# Altium schematic sheet iRat_2.1.SchDoc
size A4
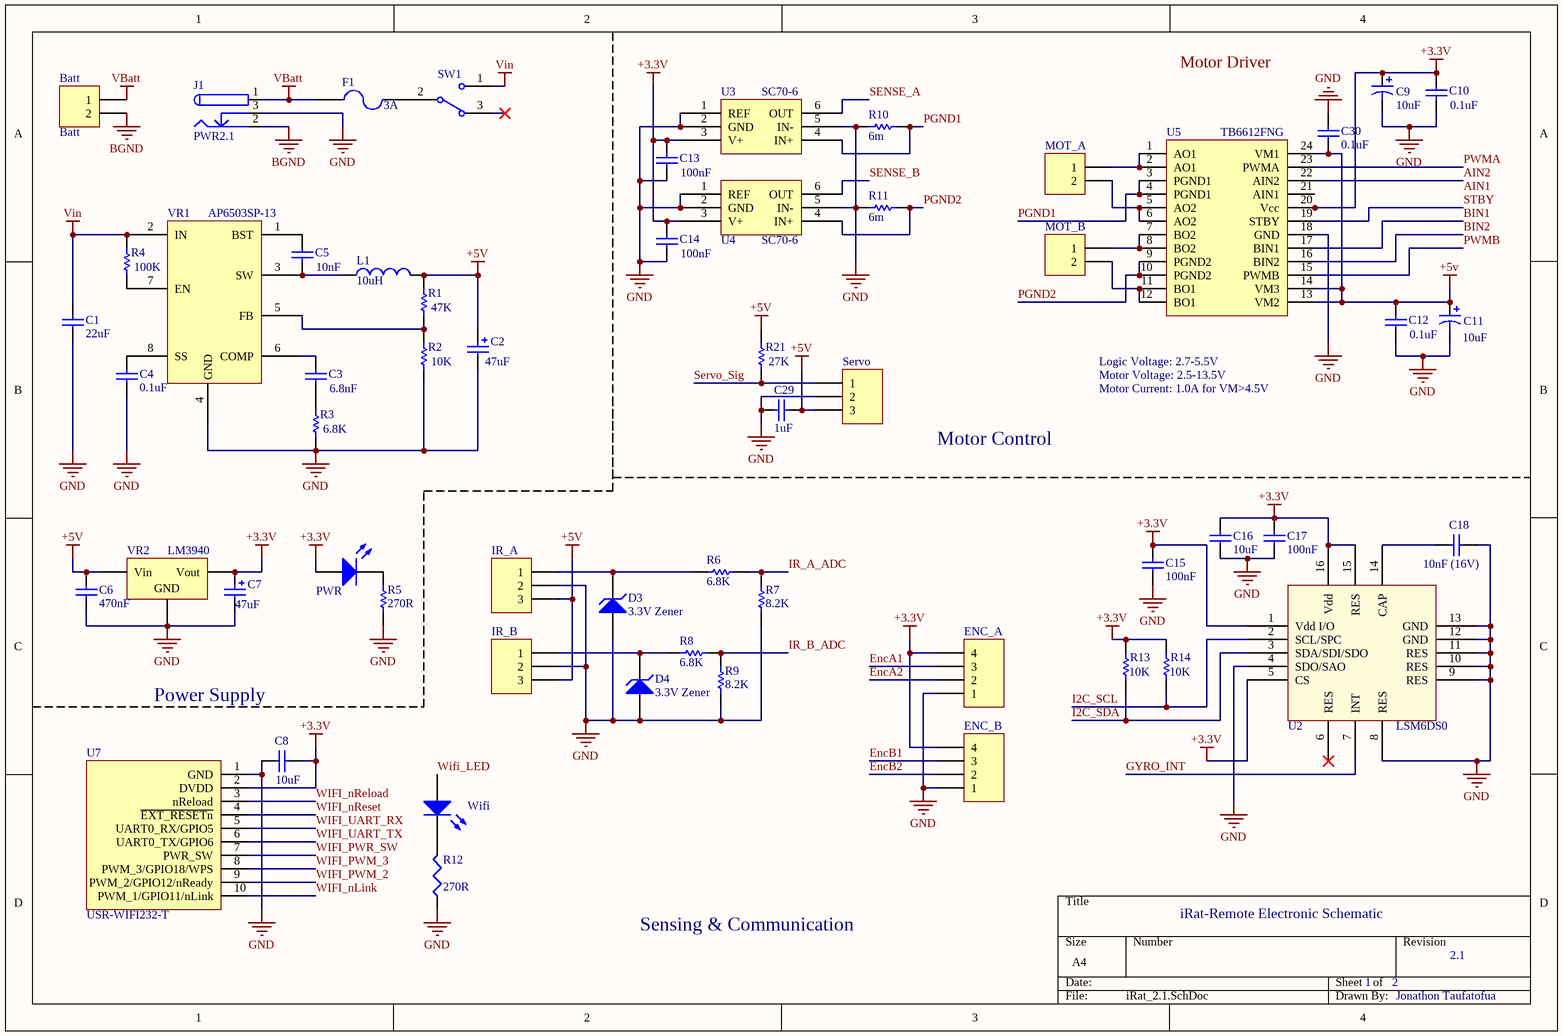
[diagram p0: iRat_2.1.SchDoc]

## Parts
Batt  Batt  [Molex 43045-0202]
C1  value 22uF  [0805E]  (hidden comment: Cap Semi)
C2  value 47uF  [Capacitor_SizeD8]  (hidden comment: Cap Pol2)
C3  value 6.8nF  [1608[0603]]  (hidden comment: Cap Semi)
C4  value 0.1uF  [1608[0603]]  (hidden comment: Cap Semi)
C5  value 10nF  [1608[0603]]  (hidden comment: Cap Semi)
C6  value 470nF  [1608[0603]]  (hidden comment: Cap Semi)
C7  value 47uF  [Capacitor_SizeD8]  (hidden comment: Cap Pol2)
C8  value 10uF  [6-0805_N]  (hidden comment: Cap Semi)
C9  value 10uF  [C0805]  (hidden comment: Cap Pol3)
C10  value 0.1uF  [1608[0603]]  (hidden comment: Cap Semi)
C11  value 10uF  [C0805]  (hidden comment: Cap Pol3)
C12  value 0.1uF  [1608[0603]]  (hidden comment: Cap Semi)
C13  value 100nF  [1608[0603]]  (hidden comment: Cap Semi)
C14  value 100nF  [1608[0603]]  (hidden comment: Cap Semi)
C15  value 100nF  [1608[0603]]  (hidden comment: Cap Semi)
C16  value 10uF  [0805E]  (hidden comment: Cap Semi)
C17  value 100nF  [1608[0603]]  (hidden comment: Cap Semi)
C18  value 10nF (16V)  [1608[0603]]  (hidden comment: Req 10nF 10%, 16V Ceramic)
C29  value 1uF  [1608[0603]]  (hidden comment: Cap Semi)
C30  value 0.1uF  [1608[0603]]  (hidden comment: Cap Semi)
D3  3.3V Zener  [MM5Z3V3T1G]
D4  3.3V Zener  [MM5Z3V3T1G]
ENC_A  Header 4  [JST PH 4-Way]  (value not drawn)
ENC_B  Header 4  [JST PH 4-Way]  (value not drawn)
F1  3A  [1812]
IR_A  Header 3  [JST PH 3-Way]  (value not drawn)
IR_B  Header 3  [JST PH 3-Way]  (value not drawn)
J1  PWR2.1  [DCP21]
L1  value 10uH  [SRP7028A-100M]  (hidden comment: Inductor)
MOT_A  Header 2  [HDR1X2]  (value not drawn)
MOT_B  Header 2  [HDR1X2]  (value not drawn)
PWR  LNJ347W83RA  [0402-A]  (value not drawn)
R1  value 47K  [J1-0603]  (hidden comment: Res Semi)
R2  value 10K  [J1-0603]  (hidden comment: Res Semi)
R3  value 6.8K  [J1-0603]  (hidden comment: Res Semi)
R4  value 100K  [J1-0603]  (hidden comment: Res Semi)
R5  value 270R  [0402]  (hidden comment: Res1)
R6  value 6.8K  [0603E]  (hidden comment: Res1)
R7  value 8.2K  [0603E]  (hidden comment: Res1)
R8  value 6.8K  [0603E]  (hidden comment: Res1)
R9  value 8.2K  [0603E]  (hidden comment: Res1)
R10  value 6m  [ERJM1WS]  (hidden comment: Shunt Resistor)
R11  value 6m  [ERJM1WS]  (hidden comment: Shunt Resistor)
R12  value 270R  [0402]  (hidden comment: Res3)
R13  value 10K  [0402]  (hidden comment: Res Semi)
R14  value 10K  [0402]  (hidden comment: Res Semi)
R21  value 27K  [0402]  (hidden comment: Res Semi)
Servo  Servo1  [JST PH 3-Way]  (value not drawn)
SW1  SW-SPDT  [Slide_Switch]  (value not drawn)
U2  LSM6DS0  [LGA16-3X3X1_N]
U3  SC70-6  [SC70]
U4  SC70-6  [SC70]
U5  TB6612FNG  [TSOP65P760X160-24N]
U7  USR-WIFI232-T  [USR-WIFI232-T]
VR1  AP6503SP-13  [SO-8EP]
VR2  LM3940  [SOT223_N]
Wifi  LNJ347W83RA  [0402-A]  (value not drawn)

## Nets
+3.3V: C7.1 C8.1 C9.1 C10.1 C13.2 C14.2 C15.2 C16.2 C17.2 ENC_A.4 ENC_B.4 PWR.1(A) R13.2 R14.2 U2.1(Vdd_I/O) U2.5(CS) U2.15(RES) U2.16(Vdd) U3.3(V+) U4.3(V+) U5.20(Vcc) U7.2(DVDD) VR2.3(Vout)
+5v: C2.1 C6.2 C11.1 C12.1 C29.2 C30.1 IR_A.3 IR_B.3 L1.2 R1.2 R21.2 Servo.3 U5.13(VM2) U5.14(VM3) U5.24(VM1) VR2.1(Vin)
BGND: Batt.2 J1.2
GND: C1.1 C2.2 C4.1 C6.1 C7.2 C8.2 C9.2 C10.2 C11.2 C12.2 C13.1 C14.1 C15.1 C16.1 C17.1 C18.1 C29.1 C30.2 D3.1(A) D4.1(A) ENC_A.1 ENC_B.1 IR_A.2 IR_B.2 J1.3 R2.1 R3.1 R5.1 R7.1 R9.1 R10.2 R11.1 R12.1 Servo.2 U2.4(SDO/SAO) U2.8(RES) U2.9(RES) U2.10(RES) U2.11(RES) U2.12(GND) U2.13(GND) U3.1(REF) U3.2(GND) U3.5(IN-) U4.1(REF) U4.2(GND) U4.5(IN-) U5.18(GND) U7.1(GND) VR1.4(GND) VR2.2(GND)
VBatt: Batt.1 F1.1 J1.1
Vin: C1.2 R4.2 SW1.1 VR1.2(IN)
AIN2: U5.22(AIN2)
BIN1: U5.17(BIN1)
BIN2: U5.16(BIN2)
EncA1: ENC_A.3
EncA2: ENC_A.2
EncB1: ENC_B.3
EncB2: ENC_B.2
GYRO_INT: U2.7(INT)
I2C_SCL: R14.1 U2.2(SCL/SPC)
I2C_SDA: R13.1 U2.3(SDA/SDI/SDO)
IR_A_ADC: R6.1 R7.2
IR_B_ADC: R8.1 R9.2
PGND1: R10.1 U3.4(IN+) U5.3(PGND1) U5.4(PGND1)
PGND2: R11.2 U4.4(IN+) U5.9(PGND2) U5.10(PGND2)
PWMA: U5.23(PWMA)
PWMB: U5.15(PWMB)
SENSE_A: U3.6(OUT)
SENSE_B: U4.6(OUT)
Servo_Sig: R21.1 Servo.1
STBY: U5.19(STBY)
Wifi_LED: Wifi.1(A)
WIFI_nLink: U7.10(PWM_1/GPIO11/nLink)
WIFI_nReload: U7.3(nReload)
WIFI_nReset: U7.4(~{EXT_RESETn})
WIFI_PWM_2: U7.9(PWM_2/GPIO12/nReady)
WIFI_PWM_3: U7.8(PWM_3/GPIO18/WPS)
WIFI_PWR_SW: U7.7(PWR_SW)
WIFI_UART_RX: U7.5(UART0_RX/GPIO5)
WIFI_UART_TX: U7.6(UART0_TX/GPIO6)
NetC3_1: C3.1 R3.2
NetC3_2: C3.2 VR1.6(COMP)
NetC4_2: C4.2 VR1.8(SS)
NetC5_1: C5.1 L1.1 VR1.3(SW)
NetC5_2: C5.2 VR1.1(BST)
NetC18_2: C18.2 U2.14(CAP)
NetD3_2: D3.2(K) IR_A.1 R6.2
NetD4_2: D4.2(K) IR_B.1 R8.2
NetF1_2: F1.2 SW1.2
NetMOT_A_1: MOT_A.1 U5.1(AO1) U5.2(AO1)
NetMOT_A_2: MOT_A.2 U5.5(AO2) U5.6(AO2)
NetMOT_B_1: MOT_B.1 U5.7(BO2) U5.8(BO2)
NetMOT_B_2: MOT_B.2 U5.11(BO1) U5.12(BO1)
NetPWR_2: PWR.2(K) R5.2
NetR1_1: R1.1 R2.2 VR1.5(FB)
NetR4_1: R4.1 VR1.7(EN)
NetR12_2: R12.2 Wifi.2(K)

Not connected (* = marked no-connect by the designer): SW1 3*; U2 6(RES)*; U5 21(AIN1); VR2 4(GND)

## Notes on the sheet
- Motor Driver
- Logic Voltage: 2.7-5.5V
- Motor Voltage: 2.5-13.5V
- Motor Control
- Motor Current: 1.0A for VM>4.5V
- Power Supply
- iRat-Remote Electronic Schematic
- Sensing & Communication
- 1
- 2
- 2.1
- Jonathon Taufatofua
- Labels drawn without touching a wire or pin: AIN1

## Library data of the parts
Batt MOT_A MOT_B = Header 2: Header, 2-Pin; LatestRevisionDate: 17-Jul-2002; LatestRevisionNote: Re-released for DXP Platform.; Publisher: Altium Limited
C1 C3-C6 C8 C10 C12-C18 C29 C30 = Cap Semi: Capacitor (Semiconductor SIM Model); Published: 8-Jun-2000; LatestRevisionDate: 29-May-2009; LatestRevisionNote: IPC-7351 Footprint Added.; PackageReference: C1206; Publisher: Altium Limited; PackageDescription: Chip Capacitor
C2 = Cap Pol2: Polarized Capacitor (Radial); Published: 8-Jun-2000; LatestRevisionDate: 17-Jul-2002; LatestRevisionNote: Re-released for DXP Platform.; PackageReference: POLAR0.8; Publisher: Altium Limited; PackageDescription: Polarized Capacitor; 2 Leads
C7 = Cap Pol2: Polarized Capacitor (Radial); Note: Needs at least 33uF for stability
C9 C11 = Cap Pol3: Polarized Capacitor (Surface Mount); Published: 8-Jun-2000; LatestRevisionDate: 29-May-2009; LatestRevisionNote: IPC-7351 Footprint Added.; PackageReference: C0805; Publisher: Altium Limited; PackageDescription: Chip Capacitor
D3 D4 = D Zener: Zener Diode; Published: 8-Jun-2000; LatestRevisionDate: 17-Jul-2002; LatestRevisionNote: Re-released for DXP Platform.; PackageReference: DIODE-0.7; Publisher: Altium Limited; PackageDescription: Diode, Thru-Hole; 2 Leads; 0.7 in Pin Spacing
ENC_A ENC_B = Header 4: Header, 4-Pin; LatestRevisionDate: 17-Jul-2002; LatestRevisionNote: Re-released for DXP Platform.; Publisher: Altium Limited
F1 = Fuse 2: Fuse; Published: 8-Jun-2000; LatestRevisionDate: 17-Jul-2002; LatestRevisionNote: Re-released for DXP Platform.; PackageReference: PIN-W2/E2.8; Publisher: Altium Limited; PackageDescription: Thru-Hole; 2 Leads
IR_A IR_B Servo = Header 3: Header, 3-Pin; LatestRevisionDate: 17-Jul-2002; LatestRevisionNote: Re-released for DXP Platform.; Publisher: Altium Limited
J1 = PWR2.5: Low Voltage Power Supply Connector; Published: 17-Dec-2003; DatasheetDocument: 09-May-2002; Publisher: Altium Limited; ComponentLink1Description: Manufacturer Link; ComponentLink1URL: http://domino.kycon.com/internet/Products.html
L1 = Inductor: Code_IEC: 1005; Published: 8-Jun-2000; LatestRevisionDate: 29-May-2009; LatestRevisionNote: IPC-7351 Footprint Added.; PackageReference: 0402-A; Publisher: Altium Limited; PackageDescription: Chip Inductor; Code_JEITA: 0402
PWR = LED2: GREEN Power LED; Published: 8-Jun-2000; LatestRevisionDate: 17-Jul-2002; LatestRevisionNote: Re-released for DXP Platform.; PackageVersion: Feb-2002; PackageReference: 3.2X1.6X1.1; Publisher: Altium Limited; PackageDescription: SM LED; 2 Flat Leads
R1-R4 R13 R14 R21 = Res Semi: Semiconductor Resistor; Published: 8-Jun-2000; LatestRevisionDate: 17-Jul-2002; LatestRevisionNote: Re-released for DXP Platform.; PackageReference: AXIAL-0.5; Publisher: Altium Limited; PackageDescription: Axial Device, Thru-Hole; 2 Leads; 0.5 in Pin Spacing
R5-R9 = Res1: Resistor; Published: 8-Jun-2000; LatestRevisionDate: 17-Jul-2002; LatestRevisionNote: Re-released for DXP Platform.; PackageReference: AXIAL-0.3; Publisher: Altium Limited; PackageDescription: Axial Device, Thru-Hole; 2 Leads; 0.3 in Pin Spacing
R10 R11 = Res1: Current Sense Resistor; Published: 8-Jun-2000; LatestRevisionDate: 17-Jul-2002; LatestRevisionNote: Re-released for DXP Platform.; PackageReference: AXIAL-0.3; Publisher: Altium Limited; PackageDescription: Axial Device, Thru-Hole; 2 Leads; 0.3 in Pin Spacing
R12 = Res3: Resistor; Published: 8-Jun-2000; LatestRevisionDate: 29-May-2009; LatestRevisionNote: IPC-7351 Footprint Added.; PackageReference: J1-0603; Publisher: Altium Limited; PackageDescription: Chip Resistor
SW1 = SW-SPDT: SPDT Subminiature Toggle Switch, Right Angle Mounting, Vertical Actuation; Published: 24-Mar-1999; LatestRevisionDate: 17-Dec-2003; LatestRevisionNote: Schematic revised, PCB Footprint replaced.; DatasheetVersion: 05-Dec-2000; PackageReference: TL36WW15050; Publisher: Altium Limited; PackageDescription: Switch; 4 Leads; ComponentLink1Description: Manufacturer Link; ComponentLink1URL: http://www.apem.com
U2 = LSM6DS0: gyroscope and accelerometer
U5 = TB6612FNG IC: Motor Driver IC
VR1 = AP6503SP-13: Adjustable Switching Regulator
VR2 = Volt Reg: Voltage Regulator; Published: 24-Mar-1999; LatestRevisionDate: 29-May-2009; LatestRevisionNote: IPC-7351 Footprint Added.; PackageReference: D2PAK; Publisher: Altium Limited; PackageDescription: 3-Pin Transistor Outline Package 2.54 mm Pitch, 15.1 mm Lead Span
Wifi = LED2: GREEN Wifi LED; Published: 8-Jun-2000; LatestRevisionDate: 17-Jul-2002; LatestRevisionNote: Re-released for DXP Platform.; PackageVersion: Feb-2002; PackageReference: 3.2X1.6X1.1; Publisher: Altium Limited; PackageDescription: SM LED; 2 Flat Leads